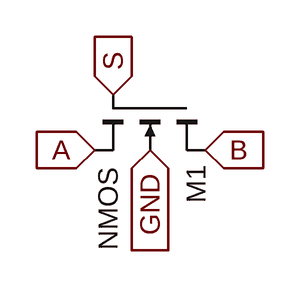
[diagram p0: schematic nmos_single_switch.asc]
nmos_single_switch.asc, the LTspice schematic file:
Version 4
SHEET 1 880 680
FLAG 160 144 S
IOPIN 160 144 In
FLAG 144 192 A
IOPIN 144 192 In
FLAG 240 192 B
IOPIN 240 192 In
FLAG 192 192 GND
IOPIN 192 192 In
SYMBOL nmos4 240 144 R90
WINDOW 0 61 8 Left 2
WINDOW 3 63 84 Left 2
SYMATTR InstName M1

The netlist it stands for:
* nmos_single_switch.asc
M1 B S A GND NMOS
.model NMOS NMOS
.model PMOS PMOS
.lib standard.mos
.backanno
.end